# EAGLE design Test_Reg (EAGLE 7.6.0)
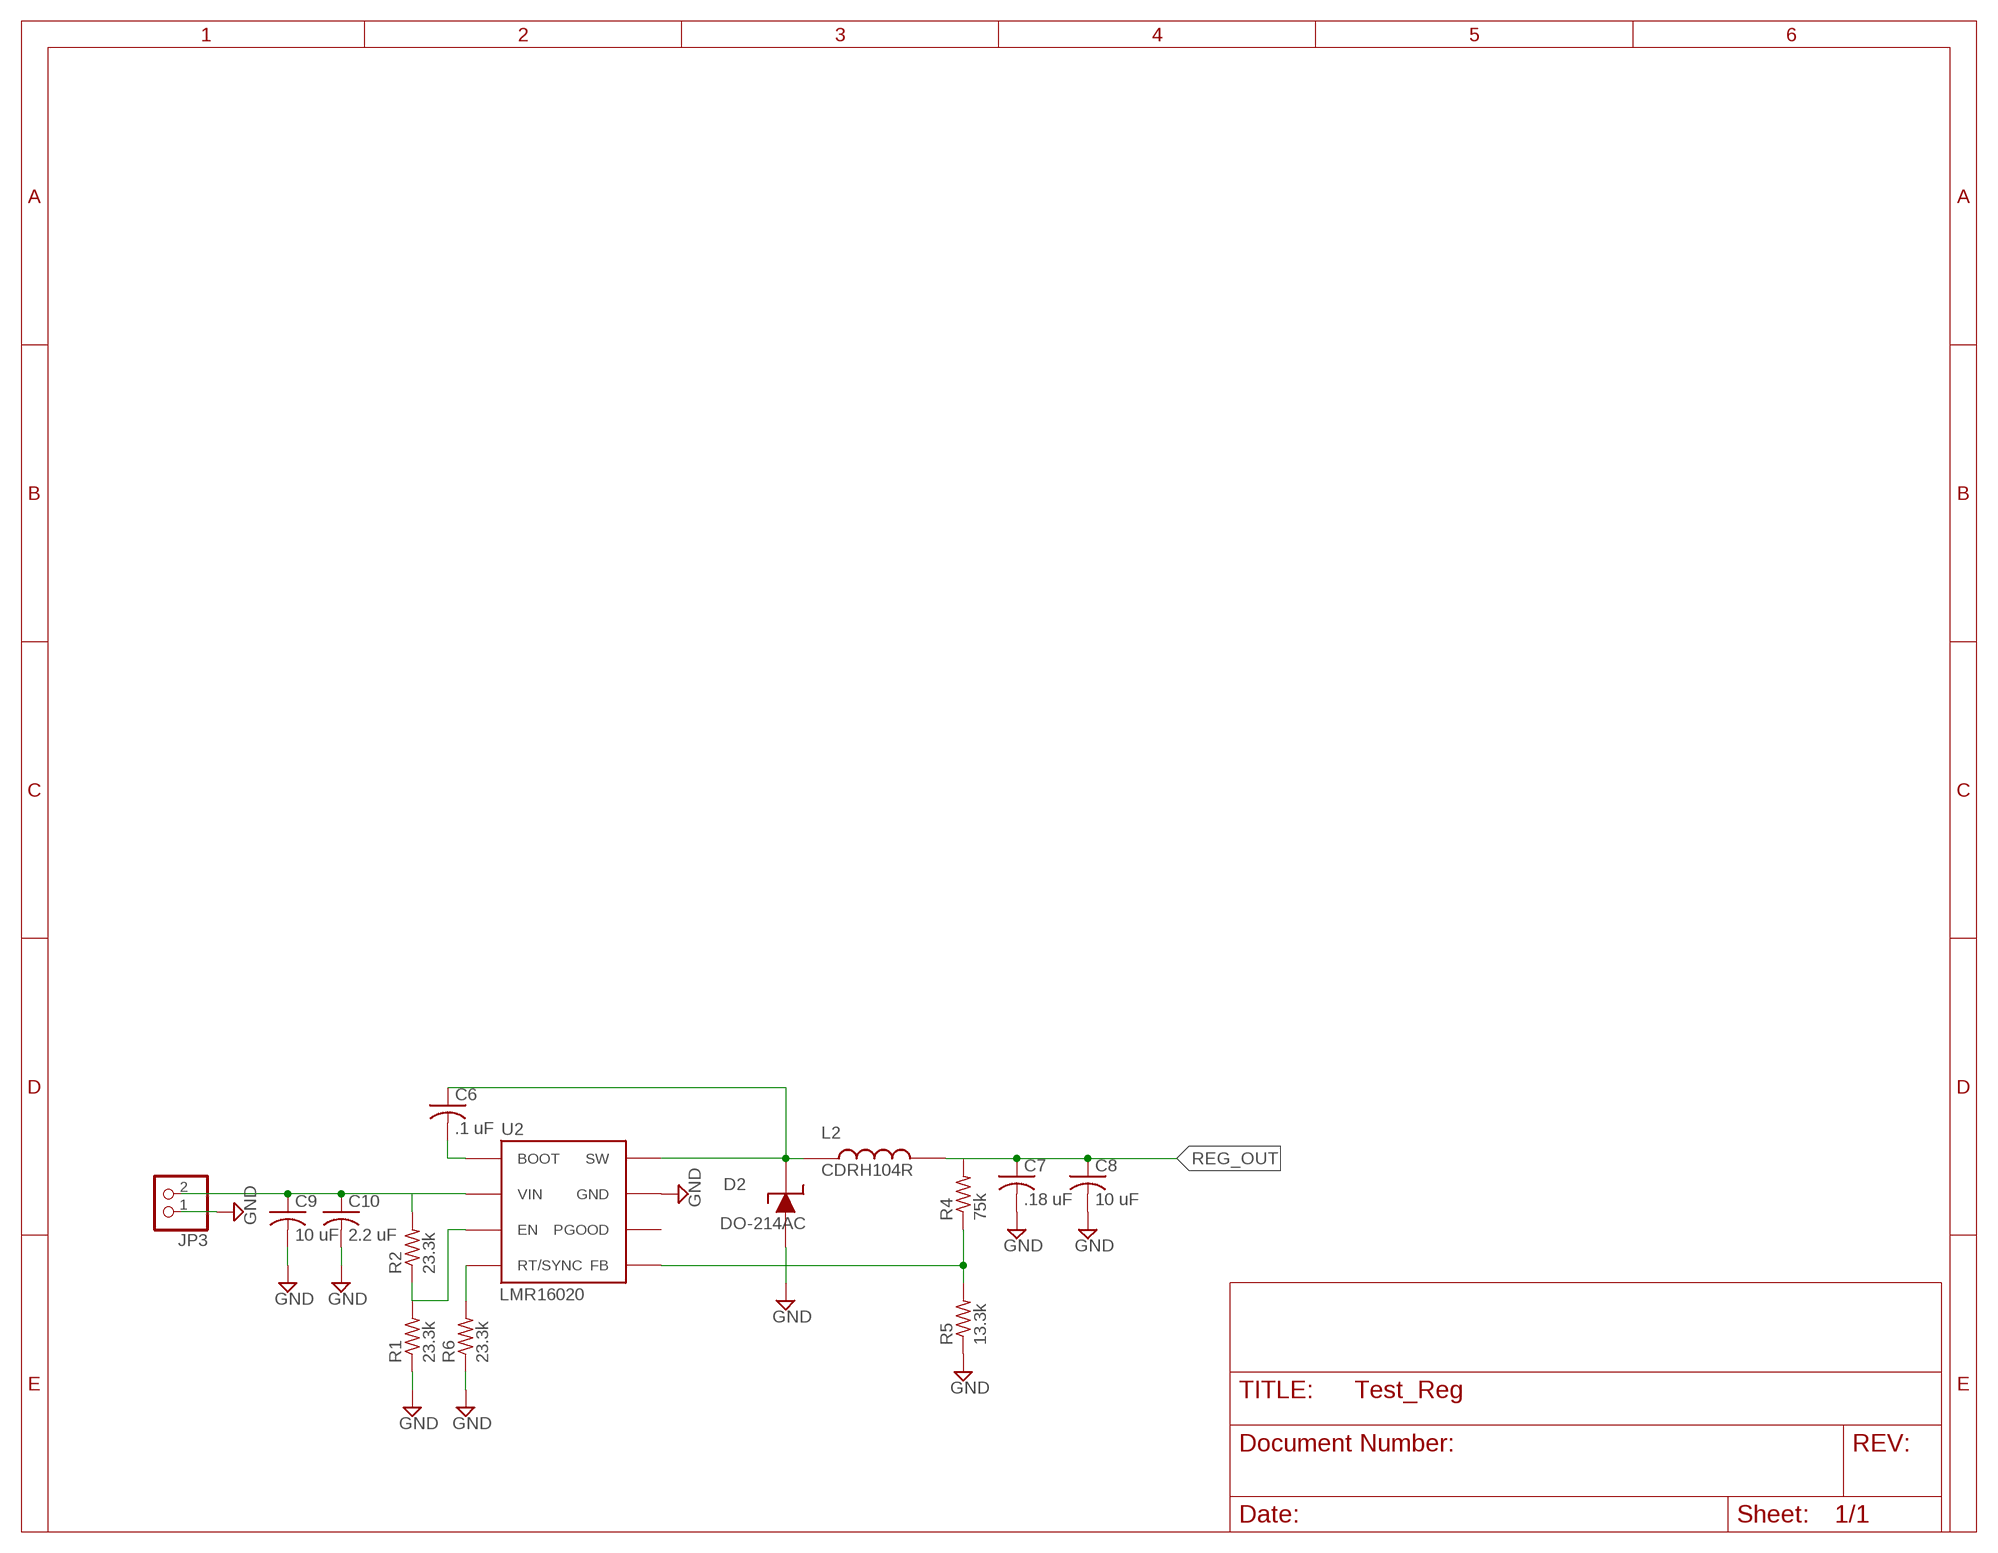
[diagram p0: schematic, sheet 1]

## Parts
C6  .1 uF  C-USC0603  [C0603]
C7  .18 uF  C-USC0603  [C0603]
C8  10 uF  C-USC0603  [C0603]
C9  10 uF  C-USC1210  [C1210]
C10  2.2 uF  C-USC1210  [C1210]
D2  DO-214AC  [DO-214AC]
JP3  PINHD-1X2  [1X02]
L2  CDRH104R  [CDRH104R]
R1  23.3k  R-US_R0603  [R0603]
R2  23.3k  R-US_R0603  [R0603]
R4  75k  R-US_R0603  [R0603]
R5  13.3k  R-US_R0603  [R0603]
R6  23.3k  R-US_R0603  [R0603]
U2  LMR16020  [SO8]

## Nets
GND: C7.2 C8.2 C9.2 C10.2 D2.P$1 JP3.1 R1.1 R5.1 R6.1 U2.P$7(GND) U2.PAD(GND)
IN: C9.1 C10.1 JP3.2 R2.2 U2.P$2(VIN)
N$1: R6.2 U2.P$4(RT/SYNC)
N$2: R1.2 R2.1 U2.P$3(EN)
N$6: C6.2 U2.P$1(BOOT)
N$7: C6.1 D2.P$2 L2.P$1 U2.P$8(SW)
N$8: R4.1 R5.2 U2.P$5(FB)
REG_OUT: C7.1 C8.1 L2.P$2 R4.2
Unconnected: U2.P$6(PGOOD)

## Library data of the parts
C6-C10 = resistor:C-US: CAPACITOR, American symbol
D2 = HASP:DO-214AC
JP3 = pinhead:PINHD-1X2: PIN HEADER
L2 = library:CDRH104R
R1 R2 R4-R6 = resistor:R-US_: RESISTOR, American symbol
U2 = HASP:LMR16020

## Board
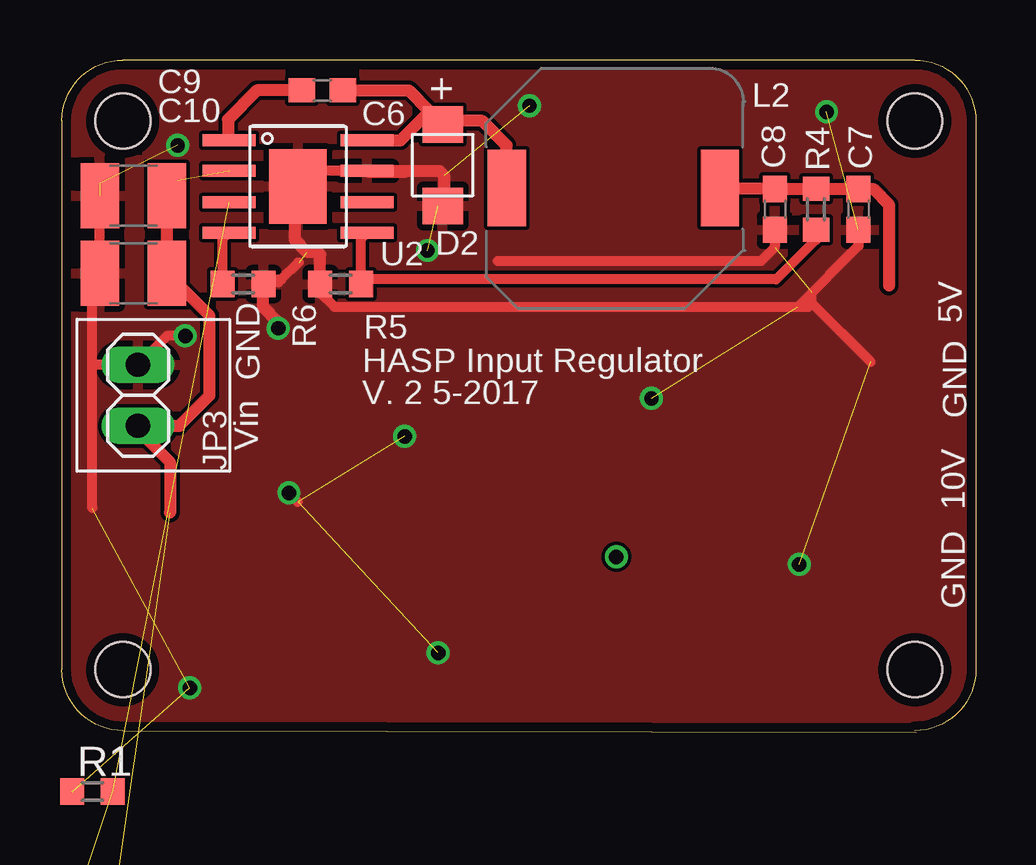
[diagram p1: board, top side]
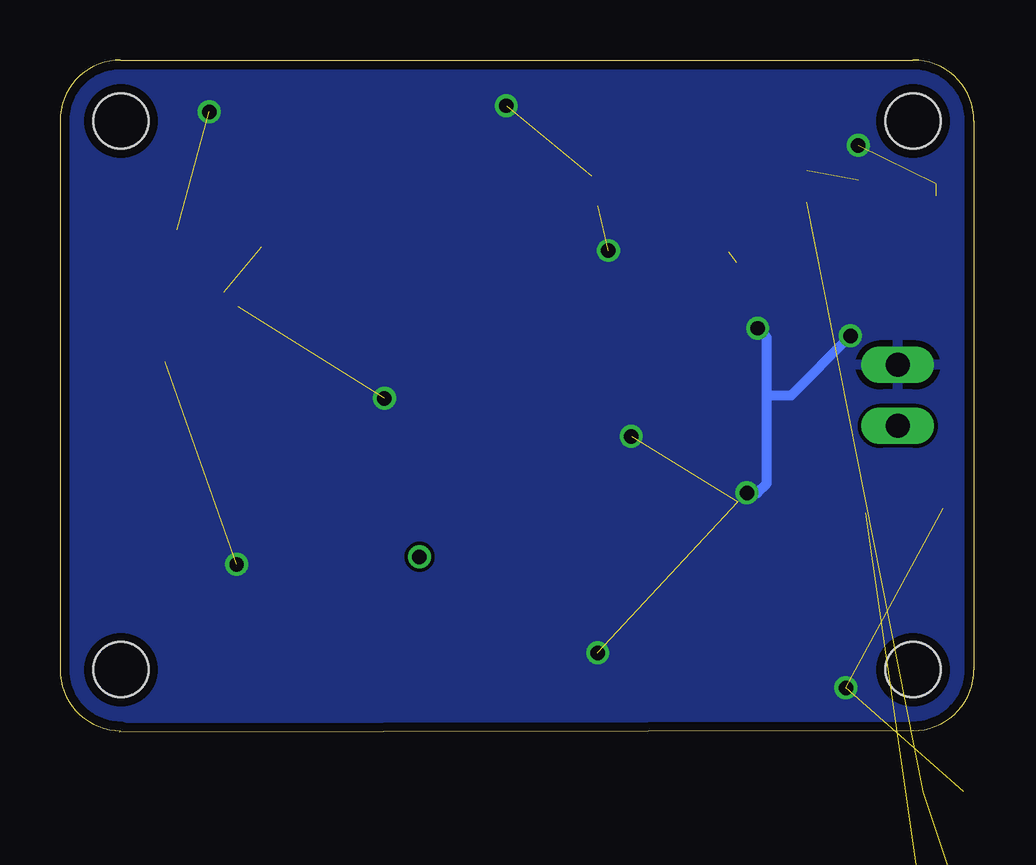
[diagram p2: board, bottom side, seen from below]

Size 38.1 x 28 mm. Coordinates in mm from the lower left corner, seen from the top.
Outline: 35.62,0 2.54,0.06 arc-90 0,2.6 0,25.46 arc-90 2.54,28 35.56,28 arc-90 38.1,25.46 38.1,2.6 arc-90 35.56,0.06
Copper layers (1*16): Top 0.0356mm / dielectric 1.5011mm / Bottom 0.0356mm
Design rules "OshPark": minimum track width 6mil, minimum drill 13mil, track to track 6mil, track to pad 6mil, pad to pad 6mil, via to via 6mil, smd to smd 6mil, copper to edge 15mil, drill to drill 6mil, minimum pad ring 7mil, minimum via ring 7mil, stop-mask expansion 3mil, vias tented up to drill 0mil, thermal gap 10mil
Holes 2.29 mm at 2.54,2.6 2.54,25.46 35.56,25.46 35.56,2.6

### Footprints (pad centres in the part's own frame; a part is rotated, then mirrored left to right if it is on the bottom)
C0603 = smd 1.1 x 1: 1 -0.85,0; 2 0.85,0
C1210 = smd 1.6 x 2.7: 1 -1.4,0; 2 1.4,0
DO-214AC = smd 1.524 x 1.676: P$1 -1.702,0; P$2 1.702,0
1X02 = drill 1.016 long: 1 -1.27,0; 2 1.27,0
CDRH104R = smd 3.2 x 1.598: P$1 0,4.445; P$2 0,-4.445
R0603 = smd 1 x 1.1: 1 -0.85,0; 2 0.85,0
SO8 = smd 0.5 x 2.2: P$1 -1.92,-2.875; P$2 -0.65,-2.875; P$3 0.65,-2.875; P$4 1.92,-2.875; P$5 1.92,2.875; P$6 0.65,2.875; P$7 -0.65,2.875; P$8 -1.92,2.875 | smd 3.1 x 2.4: PAD 0,0

### Placement (x,y rotation side)
C6  10.86,26.73 180 top
C7  33.21,21.78 270 top
C8  29.72,21.78 270 top
C9  2.98,22.35 180 top
C10  2.98,19.11 180 top
D2  15.88,23.62 90 top
JP3  3.17,14.03 270 top
L2  22.99,22.67 90 top
R1  1.27,-2.48 0 top
R2  1.27,-7.56 0 top  (outside the outline)
R4  31.43,21.78 90 top
R5  11.62,18.67 0 top
R6  7.56,18.67 180 top
U2  9.84,22.73 270 top

### Tracks (layer width: path | path; a pad name or v marks a point on that pad's centre or on a via)
GND  (via drill 0.6)  (13 unrouted)
  Top 0.406: 1.27,9.33 1.27,15.3 | 1.27,15.3 JP3.1 4.38,16.51 v5.14,16.51 | 1.27,15.3 1.27,18.8 C10.2 C9.2 | 1.58,22.86 1.59,22.86 | D2.P$1 15.67,21.92 | 14.29,23.3 12.8,23.3 U2.P$7 10.49,23.38 U2.PAD | 8.89,18.86 9.14,18.86 9.84,19.56 9.88,19.56 | 8.89,18.86 8.6,18.86 R6.1 | 9.84,9.59 v9.46,9.97 | 9.02,18.73 8.89,18.86 | C8.2 29.72,20.19 29.15,19.62 18.17,19.62 | 10.77,18.25 R5.1 10.77,18.31 11.37,17.72 30.67,17.72 | C7.2 33.21,20.26 30.67,17.72 | 31.27,17.88 31.27,18.32 | 33.72,15.43 31.27,17.88 | 30.67,17.72 31.11,17.72 31.27,17.88
  Top 0.508: R5.1 10.77,19.9 10.67,20 10.22,20 9.72,20.51 9.72,22.61 U2.PAD | U2.P$7 15.73,23.38 15.94,23.18 15.94,21.98 D2.P$1 | v9.02,16.83 9.02,17.08 8.38,17.72 8.38,18.64 R6.1
  Bottom 0.406: v9.46,9.97 9.02,9.97 8.64,10.35 8.64,14.03 | 8.64,14.03 8.64,16.45 v9.02,16.83 | 8.64,14.03 7.62,14.03 v5.14,16.51
  other vias: 4.83,24.45 19.49,26.1 31.88,25.84 24.57,13.91 14.29,12.32 15.68,3.3 5.33,1.84 30.73,6.99 15.24,20.07
  pour Top: 2.54,28 35.56,28 arc-90 39.37,25.46 38.1,2.6 arc-90 35.56,0.06 2.54,0.06 arc-90 0,2.6 0,25.46 arc-90
  pour Bottom: 2.54,28 35.56,28 arc-90 46.99,25.46 38.1,2.6 arc-90 35.56,0.06 2.54,0.06 arc-90 0,2.6 0,25.46 arc-90
IN  (2 unrouted)
  Top 0.406: C9.1 4.38,22.55
  Top 0.508: 4.51,9.14 4.51,11.24 3.17,12.57 JP3.2 4.89,12.76 6.16,14.03 6.16,17.34 C10.1 C9.1 4.38,22.08 | 4.83,22.99 4.38,22.55
N$1
  Top 0.406: R6.2 6.71,20.55 U2.P$4
N$2  (2 unrouted)
N$6
  Top 0.508: C6.2 8.13,26.73 6.92,25.53 6.92,24.7 U2.P$1
N$7
  Top 0.508: L2.P$1 18.54,24.45 17.53,25.46 16.02,25.46 D2.P$2 15.33,25.87 | C6.1 14.46,26.73 15.33,25.87 | U2.P$8 14.11,24.65 15.33,25.87
N$8
  Top 0.406: U2.P$5 12.47,20.57 R5.2 12.66,18.86 29.78,18.86 31.43,20.51 R4.1
N$30  (via drill 0.6)
  other vias: 23.11,7.3
REG_OUT
  Top 0.508: L2.P$2 29.68,22.67 C8.1 R4.2 C7.1 33.82,22.63 34.48,21.97 34.48,18.61

### Text on the board
tPlace: 5V | GND | HASP Input Regulator | Vin | GND | V. 2 5-2017 | 10V | GND